# EAGLE design pcb (EAGLE 9.6.2)
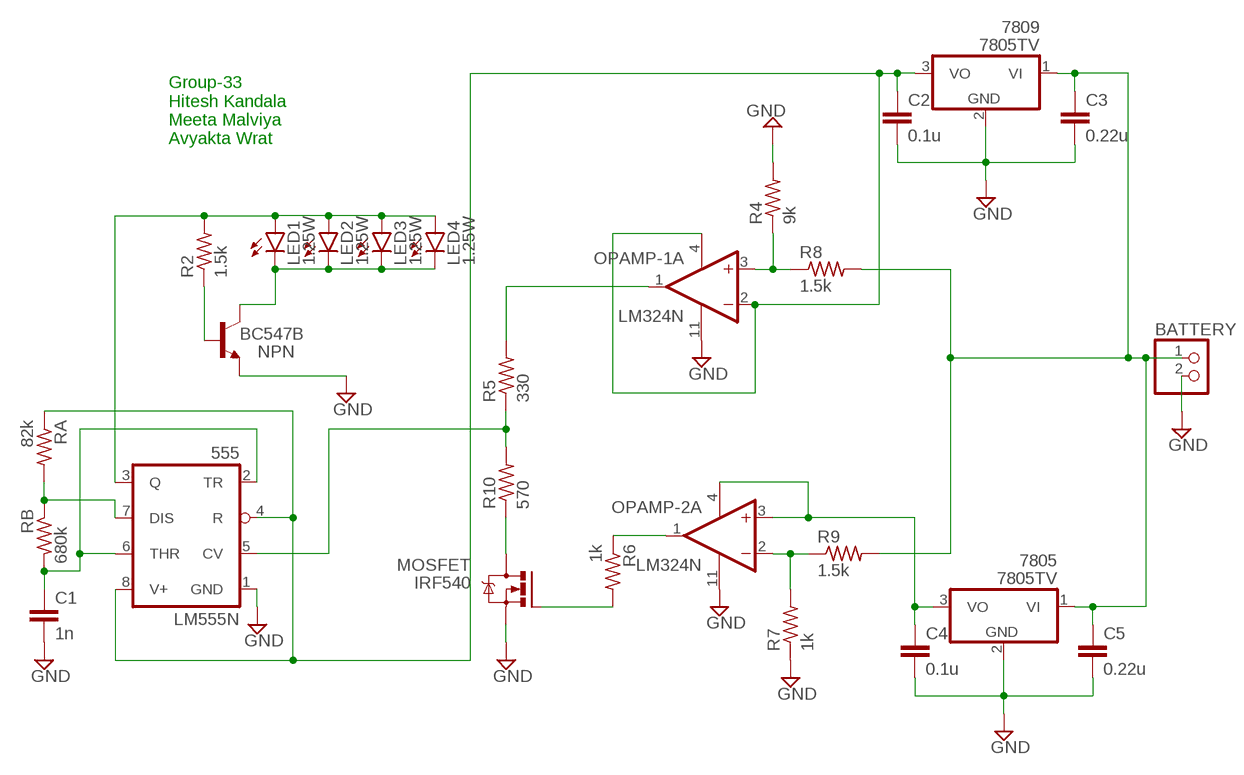
[diagram p0: schematic, sheet 1]

## Parts
555  LM555N  [DIL08]
7805  7805TV  [TO220V]
7809  7805TV  [TO220V]
BATTERY  PINHD-1X2  [1X02]
C1  1n  C-EU050-025X075  [C050-025X075]
C2  0.1u  C-EU050-025X075  [C050-025X075]
C3  0.22u  C-EU050-025X075  [C050-025X075]
C4  0.1u  C-EU050-025X075  [C050-025X075]
C5  0.22u  C-EU050-025X075  [C050-025X075]
LED1  1.25W  LED5MM  [LED5MM]
LED2  1.25W  LED5MM  [LED5MM]
LED3  1.25W  LED5MM  [LED5MM]
LED4  1.25W  LED5MM  [LED5MM]
MOSFET  IRF540  [TO220BV]
NPN  BC547B  [TO92]
OPAMP-1  LM324N  [DIL14]
OPAMP-2  LM324N  [DIL14]
R2  1.5k  R-US_0207/10  [0207/10]
R4  9k  R-US_0207/10  [0207/10]
R5  330  R-US_0207/10  [0207/10]
R6  1k  R-US_0207/10  [0207/10]
R7  1k  R-US_0207/10  [0207/10]
R8  1.5k  R-US_0207/10  [0207/10]
R9  1.5k  R-US_0207/10  [0207/10]
R10  570  R-US_0207/10  [0207/10]
RA  82k  R-US_0207/10  [0207/10]
RB  680k  R-US_0207/10  [0207/10]

## Nets
GND: 555.1(GND) 7805.2(GND) 7809.2(GND) BATTERY.2 C1.2 C2.2 C3.2 C4.2 C5.2 MOSFET.S NPN.1(E) OPAMP-1.11(P:V-) OPAMP-2.11(P:V-) R4.2 R7.1
N$1: 555.4(R) 555.8(V+) 7809.3(VO) C2.1 OPAMP-1.2(A:-IN) OPAMP-1.4(P:V+) RA.1
N$2: 555.2(TR) 555.6(THR) C1.1 RB.2
N$3: 555.3(Q) LED1.A LED2.A LED3.A LED4.A R2.2
N$4: 555.7(DIS) RA.2 RB.1
N$5: 7805.1(VI) 7809.1(VI) BATTERY.1 C3.1 C5.1 R8.2 R9.2
N$6: NPN.2(B) R2.1
N$7: OPAMP-1.3(A:+IN) R4.1 R8.1
N$9: OPAMP-2.2(A:-IN) R7.2 R9.1
N$11: 7805.3(VO) C4.1 OPAMP-2.3(A:+IN) OPAMP-2.4(P:V+)
N$12: OPAMP-2.1(A:OUT) R6.1
N$13: 555.5(CV) R5.1 R10.2
N$14: OPAMP-1.1(A:OUT) R5.2
N$15: MOSFET.D R10.1
N$16: MOSFET.G R6.2
N$17: LED1.K(C) LED2.K(C) LED3.K(C) LED4.K(C) NPN.3(C)
Unconnected: OPAMP-1.5(B:+IN) OPAMP-1.6(B:-IN) OPAMP-1.7(B:OUT) OPAMP-1.8(C:OUT) OPAMP-1.9(C:-IN) OPAMP-1.10(C:+IN) OPAMP-1.12(D:+IN) OPAMP-1.13(D:-IN) OPAMP-1.14(D:OUT) OPAMP-2.5(B:+IN) OPAMP-2.6(B:-IN) OPAMP-2.7(B:OUT) OPAMP-2.8(C:OUT) OPAMP-2.9(C:-IN) OPAMP-2.10(C:+IN) OPAMP-2.12(D:+IN) OPAMP-2.13(D:-IN) OPAMP-2.14(D:OUT)

## Notes on the sheet
- Group-33
  Hitesh Kandala
  Meeta Malviya
  Avyakta Wrat

## Library data of the parts
555 = linear:*555: TIMER
7805 7809 = linear:78*: Positive VOLTAGE REGULATOR Source: http://cache.national.com/ds/LM/LM78L05.pdf http://www.fairchildsemi.com/ds/LM/LM7805.pdf
BATTERY = pinhead:PINHD-1X2: PIN HEADER
C1-C5 = rcl:C-EU: CAPACITOR, European symbol; SPICEPREFIX: C
LED1-LED4 = led:LED: LED OSRAM: - CHIPLED LG R971, LG N971, LY N971, LG Q971, LY Q971, LO R971, LY R971 LH N974, LH R974 LS Q976, LO Q976, LY Q976 LO Q996 - Hyper CHIPLED LW Q18S LB Q993, LB Q99A, LB R99A - SideLED LS A670, LO A670, LY A670, LG A670, LP A670 LB A673, LV A673, LT A673, LW A673 LH A674 LY A675 LS A676, LA A676, LO A676, LY A676, LW A676 LS A679, LY A679, LG A679 - Hyper Micro SIDELED® LS Y876, LA Y876, LO Y876, LY Y876 LT Y87S - SmartLED LW L88C, LW L88S LB L89C, LB L89S, LG L890 LS L89K, LO L89K, LY L89K LS L896, LA L896, LO L896, LY L896 - TOPLED LS T670, LO T670, LY T670, LG T670, LP T670 LSG T670, LSP T670, LSY T670, LOP T670, LYG T670 LG T671, LOG T671, LSG T671 LB T673, LV T673, LT T673, LW T673 LH T674 LS T676, LA T676, LO T676, LY T676, LB T676, LH T676, LSB T676, LW T676 LB T67C, LV T67C, LT T67C, LS T67K, LO T67K, LY T67K, LW E67C LS E67B, LA E67B, LO E67B, LY E67B, LB E67C, LV E67C, LT E67C LW T67C LS T679, LY T679, LG T679 LS T770, LO T770, LY T770, LG T770, LP T770 LB T773, LV T773, LT T773, LW T773 LH T774 LS E675, LA E675, LY E675, LS T675 LS T776, LA T776, LO T776, LY T776, LB T776 LHGB T686 LT T68C, LB T68C - Hyper Mini TOPLED® LB M676 - Mini TOPLED Santana® LG M470 LS M47K, LO M47K, LY M47K Source: http://www.osram.convergy.de LUXEON: - LUMILED® LXK2-PW12-R00, LXK2-PW12-S00, LXK2-PW14-U00, LXK2-PW14-V00 LXK2-PM12-R00, LXK2-PM12-S00, LXK2-PM14-U00 LXK2-PE12-Q00, LXK2-PE12-R00, LXK2-PE12-S00, LXK2-PE14-T00, LXK2-PE14-U00 LXK2-PB12-K00, LXK2-PB12-L00, LXK2-PB12-M00, LXK2-PB14-N00, LXK2-PB14-P00, LXK2-PB14-Q00 LXK2-PR12-L00, LXK2-PR12-M00, LXK2-PR14-Q00, LXK2-PR14-R00 LXK2-PD12-Q00, LXK2-PD12-R00, LXK2-PD12-S00 LXK2-PH12-R00, LXK2-PH12-S00 LXK2-PL12-P00, LXK2-PL12-Q00, LXK2-PL12-R00 Source: www.luxeon.com KINGBRIGHT: KA-3528ASYC Source: www.kingbright.com
MOSFET = transistor-power:IRF540: HEXFET Power MOSFET
NPN = transistor-npn:BC547*: NPN Transistor
OPAMP-1 OPAMP-2 = linear:LM324: OP AMP
R2 R4-R10 RA RB = rcl:R-US_: RESISTOR, American symbol; SPICEPREFIX: R

## Board
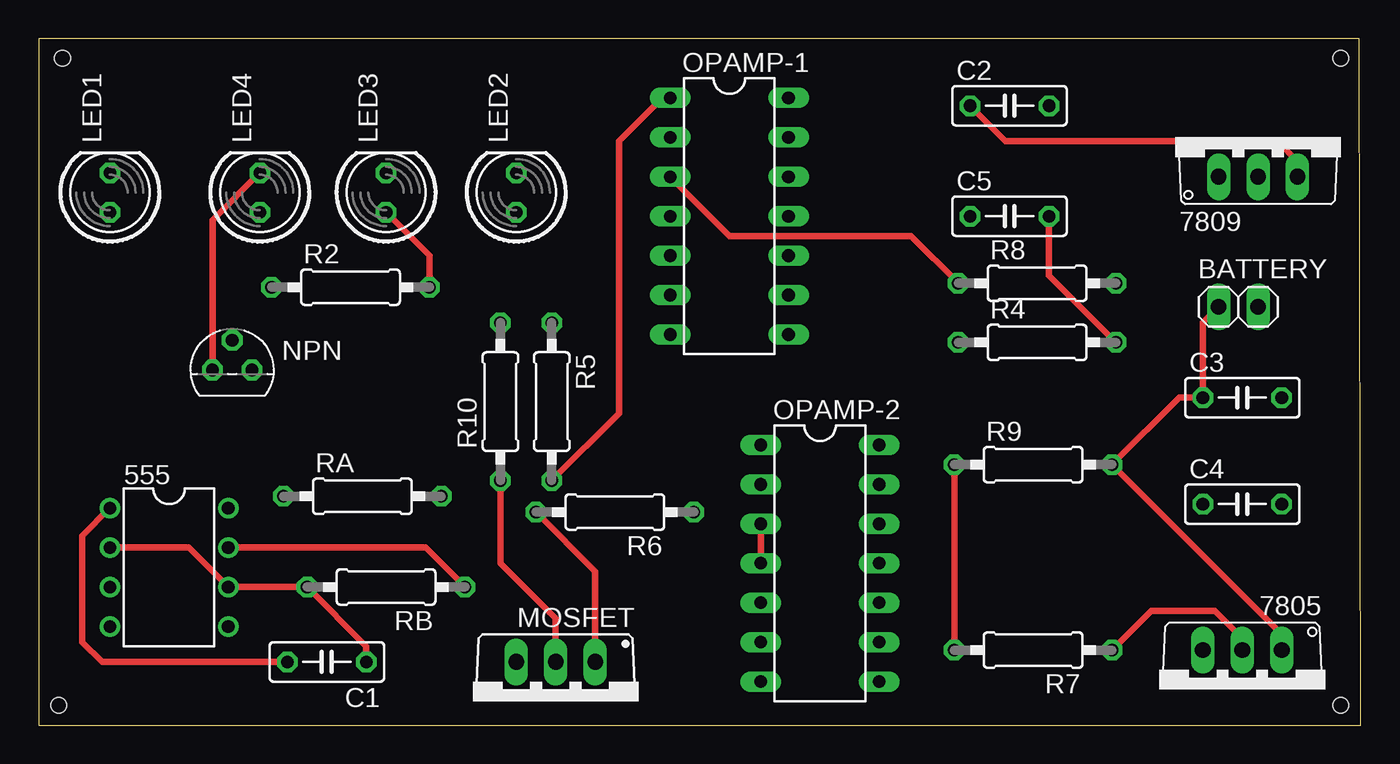
[diagram p1: board, top side]
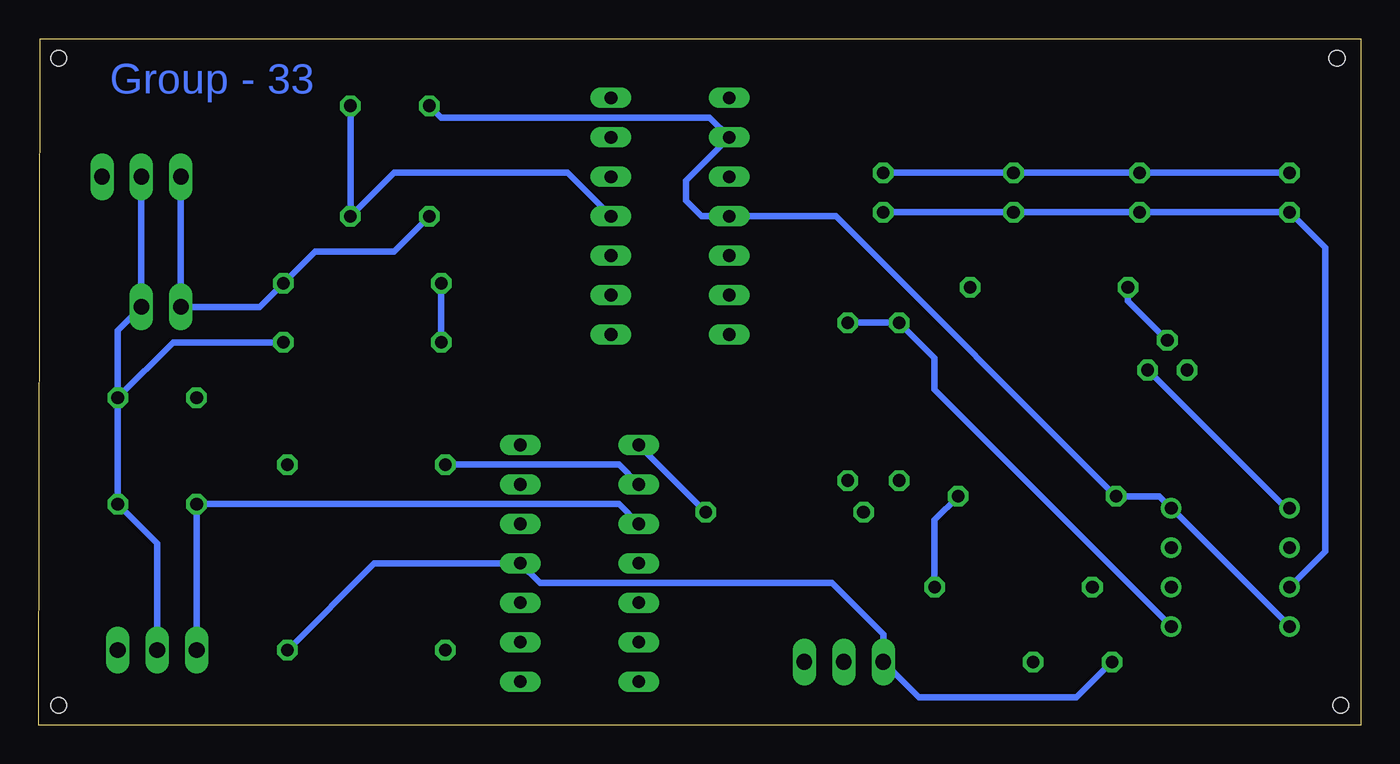
[diagram p2: board, bottom side, seen from below]

Size 85.09 x 44.19 mm. Coordinates in mm from the lower left corner, seen from the top.
Outline: 0,0 85.09,0 85.01,44.19 0,44.19 0,0
Copper layers (1*16): Top 0.035mm / dielectric 1.5mm / Bottom 0.035mm
Design rules "default *": minimum track width 16mil, minimum drill 0.8mm, track to track 16mil, track to pad 16mil, pad to pad 16mil, via to via 16mil, smd to smd 16mil, copper to edge 40mil, drill to drill 6mil, minimum pad ring 10mil, minimum via ring 8mil, stop-mask expansion 4mil, vias tented up to drill 0mil, thermal gap 10mil
Holes 1 mm at 1.52,42.93 1.27,1.27 83.82,42.93 83.82,1.27

### Footprints (pad centres in the part's own frame; a part is rotated, then mirrored left to right if it is on the bottom)
DIL08 = drill 0.813 pad 1.27: 1 -3.81,-3.81; 2 -1.27,-3.81; 3 1.27,-3.81; 4 3.81,-3.81; 5 3.81,3.81; 6 1.27,3.81; 7 -1.27,3.81; 8 -3.81,3.81
TO220V = drill 1.016 long: 1 -2.54,-2.54; 2 0,-2.54; 3 2.54,-2.54
1X02 = drill 1.016 long: 1 -1.27,0; 2 1.27,0
C050-025X075 = drill 0.813 octagon: 1 -2.54,0; 2 2.54,0
LED5MM = drill 0.813 octagon: A -1.27,0; K 1.27,0
TO220BV = drill 1.016 long: D 0,-2.54; G -2.54,-2.54; S 2.54,-2.54
TO92 = drill 0.813 octagon: 1 1.27,0; 2 0,1.905; 3 -1.27,0
DIL14 = drill 0.813 long: 1 -7.62,-3.81; 2 -5.08,-3.81; 3 -2.54,-3.81; 4 0,-3.81; 5 2.54,-3.81; 6 5.08,-3.81; 7 7.62,-3.81; 8 7.62,3.81; 9 5.08,3.81; 10 2.54,3.81; 11 0,3.81; 12 -2.54,3.81; 13 -5.08,3.81; 14 -7.62,3.81
0207/10 = drill 0.813 octagon: 1 -5.08,0; 2 5.08,0

### Placement (x,y rotation side)
555  8.38,10.16 270 top
7805  77.47,2.29 180 top
7809  78.49,37.85 0 top
BATTERY  77.22,26.92 0 top
C1  18.54,4.06 180 top
C2  62.48,39.88 0 top
C3  77.47,21.08 0 top
C4  77.47,14.22 0 top
C5  62.48,32.77 0 top
LED1  4.57,34.29 90 top
LED2  30.73,34.29 90 top
LED3  22.35,34.29 90 top
LED4  14.22,34.29 90 top
MOSFET  33.27,1.52 180 top
NPN  12.45,22.86 0 top
OPAMP-1  44.45,32.77 270 top
OPAMP-2  50.29,10.41 270 top
R2  20.07,28.19 0 top
R4  64.26,24.64 0 top
R5  33.02,20.83 270 top
R6  37.08,13.72 180 top
R7  64.01,4.83 180 top
R8  64.26,28.45 0 top
R9  64.01,16.76 0 top
R10  29.72,20.83 90 top
RA  20.83,14.73 0 top
RB  22.35,8.89 180 top

### Tracks (layer width: path | path; a pad name or v marks a point on that pad's centre or on a via)
GND
  Top 0.406: 555.1 2.79,12.19 2.79,5.33 4.06,4.06 C1.2 | R7.1 71.63,7.37 75.69,7.37 77.47,5.59 7805.2 | C5.2 65.02,28.96 R4.2
  Bottom 0.406: C1.2 18.29,1.78 28.45,1.78 MOSFET.S 30.73,5.84 34.04,9.14 52.83,9.14 OPAMP-2.11 63.5,10.41 R7.1 | 7805.2 77.47,11.68 C4.2 C3.2 | R4.2 76.45,24.64 C3.2 | C3.2 80.01,25.4 BATTERY.2 7809.2 | NPN.1 4.83,13.97 555.1 | C2.2 C5.2 62.23,35.56 51.05,35.56 OPAMP-1.11
N$1
  Top 0.406: C2.1 62.23,37.59 79.76,37.59 81.03,36.32 7809.3
  Bottom 0.406: 555.4 555.8 12.95,14.73 RA.1 33.78,32.77 OPAMP-1.4 42.42,32.77 43.43,33.78 43.43,35.05 OPAMP-1.2 41.91,39.12 59.18,39.12 C2.1
N$2
  Top 0.406: 555.2 9.65,11.43 555.6 RB.2 21.08,5.08 C1.1
N$3
  Top 0.406: LED3.A 25.15,30.23 R2.2
  Bottom 0.406: 555.3 2.29,11.18 2.29,30.73 LED1.A LED4.A LED3.A LED2.A
N$4
  Top 0.406: RB.1 24.89,11.43 555.7
  Bottom 0.406: RA.2 27.43,13.21 RB.1
N$5
  Top 0.406: BATTERY.1 74.93,25.91 C3.1 73.41,21.08 R9.2 80.01,5.84 7805.1
  Bottom 0.406: 7809.1 BATTERY.1 70.87,26.92 R8.2 67.31,30.48 62.23,30.48 C5.1
N$6
  Bottom 0.406: NPN.2 14.99,27.3 R2.1
N$7
  Top 0.406: OPAMP-1.3 44.45,31.5 56.13,31.5 R8.1
  Bottom 0.406: R8.1 R4.1
N$9
  Top 0.406: R9.1 R7.2
  Bottom 0.406: OPAMP-2.2 47.75,16.76 R9.1
N$11
  Top 0.406: OPAMP-2.3 OPAMP-2.4
  Bottom 0.406: 7805.3 C4.1 47.75,14.22 OPAMP-2.3
N$12
  Bottom 0.406: R6.1 OPAMP-2.1
N$13
  Bottom 0.406: 555.5 27.43,21.59 27.43,23.62 R10.2 R5.1
N$14
  Top 0.406: R5.2 37.34,20.07 37.34,37.59 40.13,40.39 OPAMP-1.1
N$15
  Top 0.406: R10.1 29.72,10.41 33.27,6.86 MOSFET.D
N$16
  Top 0.406: R6.2 35.81,9.91 MOSFET.G
N$17
  Top 0.406: NPN.3 11.18,32.51 LED4.K
  Bottom 0.406: LED1.K LED4.K LED3.K LED2.K

### Text on the board
Bottom: Group - 33